# Altium project PCB_Project.PrjPcb
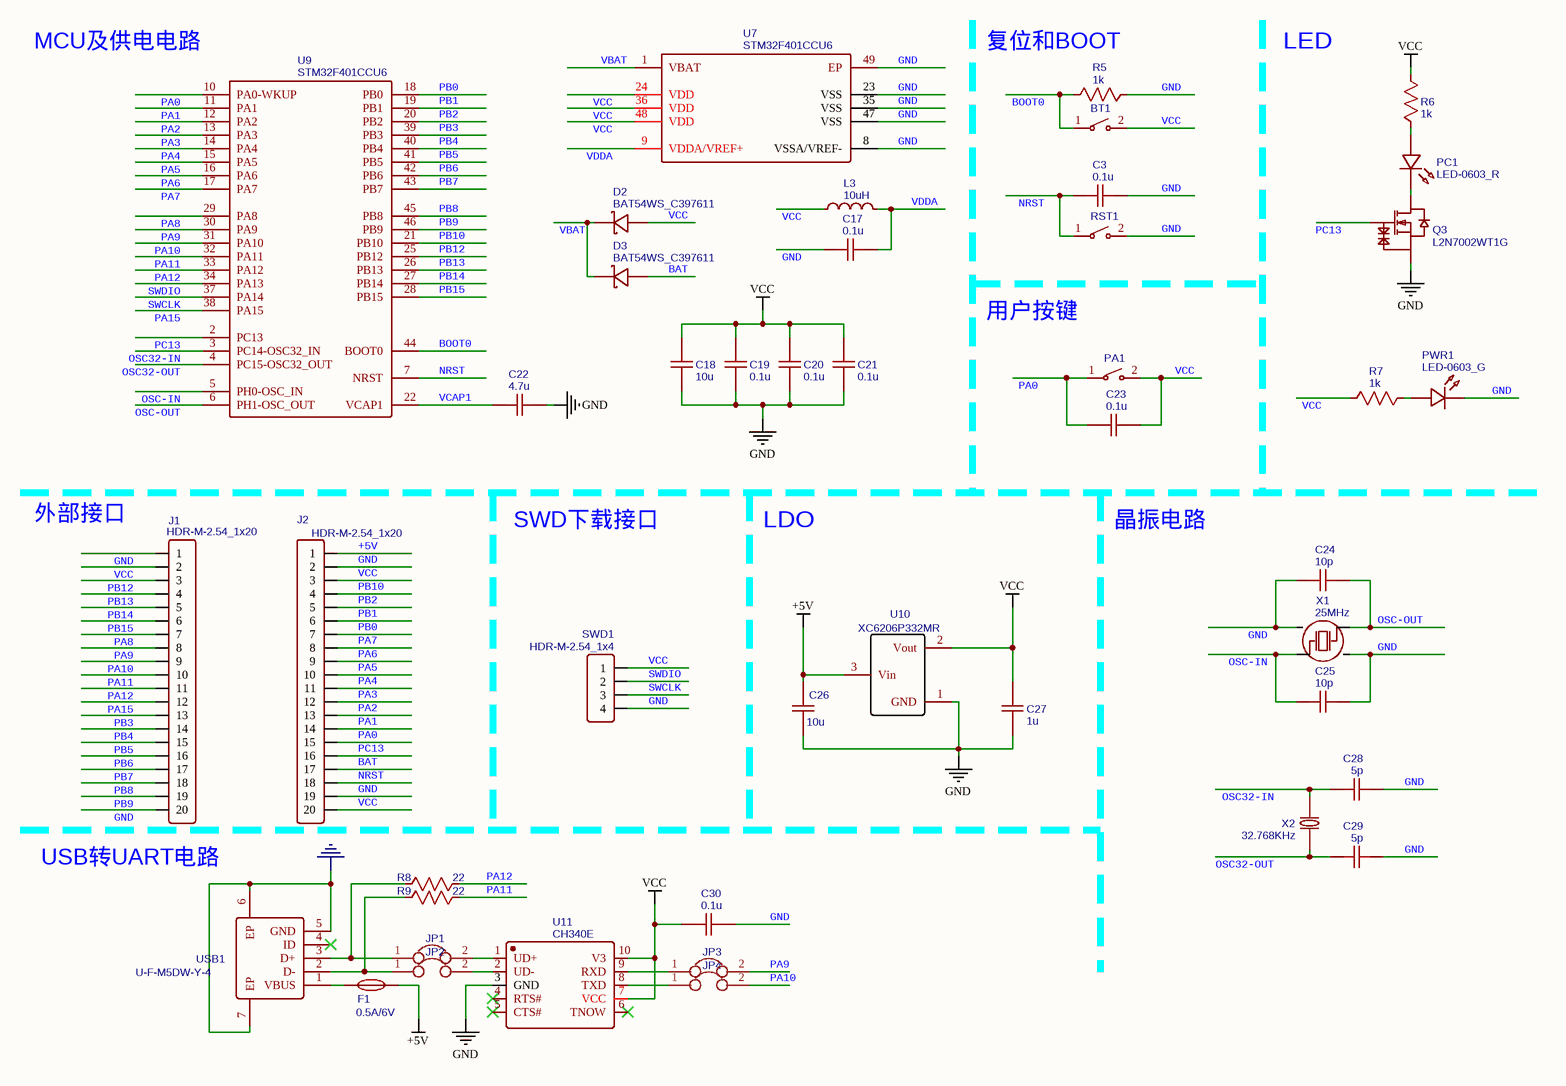
[diagram p0: Sheet1.SchDoc]
2 sheets, 107 parts. Net scope: hierarchical (ports join the sheet entries above them; power ports are global).
Board files: PCB1fbb.PcbDoc, body.PcbDoc
Sheets:
  Sheet1.SchDoc
  body.schdoc

## Sheet Sheet1.SchDoc
size A3; SheetNumber: 1; SheetTotal: 1

### Parts
BT1  TS-1088R-02026  [SW-SMD_L3.9-W3.0-P4.45]  (value not drawn)
C3  0.1u  [0603]
C17  0.1u  [0603]
C18  10u  [0603]
C19  0.1u  [0603]
C20  0.1u  [0603]
C21  0.1u  [0603]
C22  4.7u  [0603]
C23  0.1u  [0603]
C24  10p  [0603]
C25  10p  [0603]
C26  10u  [0603]
C27  1u  [0603]
C28  5p  [0603]
C29  5p  [0603]
C30  0.1u  [0603]
D2  BAT54WS_C397611
D3  BAT54WS_C397611
F1  0.5A/6V  [F0603]
J1  HDR-M-2.54_1x20  [HDR-M-2.54_1X20]
J2  HDR-M-2.54_1x20  [HDR-M-2.54_1X20]
JP1  JUMPER  [JUMPER-0603]  (value not drawn)
JP2  JUMPER  [JUMPER-0603]  (value not drawn)
JP3  JUMPER  [JUMPER-0603]  (value not drawn)
JP4  JUMPER  [JUMPER-0603]  (value not drawn)
L3  10uH  [L0805]
PA1  TS-1088R-02026  [SW-SMD_L3.9-W3.0-P4.45]  (value not drawn)
PC1  LED-0603_R  [LED0603_RED]
PWR1  LED-0603_G  [LED0603_GREEN]
Q3  L2N7002WT1G  [SC-70-3_L2.1-W1.3-P1.30-LS2.1-BR]
R5  1k  [R0603]
R6  1k  [R0603]
R7  1k  [R0603]
R8  22  [R0603]
R9  22  [R0603]
RST1  TS-1088R-02026  [SW-SMD_L3.9-W3.0-P4.45]  (value not drawn)
SWD1  HDR-M-2.54_1x4  [HDR-M-2.54_1X4]
U7  STM32F401CCU6  [UFQFPN-48_L7.0-W7.0-P0.50-BL-EP]
U9  STM32F401CCU6  [UFQFPN-48_L7.0-W7.0-P0.50-BL-EP]
U10  XC6206P332MR  [SOT-23(SOT-23-3)]
U11  CH340E  [MSOP-10_L3.0-W3.0-P0.50-LS5.0-BL]
USB1  U-F-M5DW-Y-4  [MICRO-USB-A12]
X1  25MHz  [OSC-SMD_4P-L3.2-W2.5-BL]
X2  32.768KHz  [OSC-SMD_L3.2-W1.5]

### Nets
+5V: C26.2 F1.2 J2.1 U10.3(Vin)
GND: C3.1 C17.2 C18.1 C19.1 C20.1 C21.1 C22.2 C24.1 C25.2 C26.1 C27.1 C28.1 C29.1 C30.1 J1.1 J1.20 J2.2 J2.19 PWR1.2 Q3.2(S) R5.2 RST1.2 SWD1.4 U7.8(VSSA/VREF-) U7.23(VSS) U7.35(VSS) U7.47(VSS) U7.49(EP) U10.1(GND) U11.3(GND) USB1.5(GND) USB1.6(EP) USB1.7(EP) X1.2 X1.4
VCC: BT1.2 C18.2 C19.2 C20.2 C21.2 C23.1 C27.2 C30.2 D2.2(A) J1.2 J2.3 J2.20 L3.1 PA1.2 R6.2 R7.2 SWD1.1 U7.24(VDD) U7.36(VDD) U7.48(VDD) U10.2(Vout) U11.7(VCC) U11.10(V3)
BAT: D3.2(A) J2.17
BOOT0: BT1.1 R5.1 U9.44(BOOT0)
NRST: C3.2 J2.18 RST1.1 U9.7(NRST)
OSC32-IN: C28.2 U9.3(PC14-OSC32_IN) X2.2
OSC32-OUT: C29.2 U9.4(PC15-OSC32_OUT) X2.1
OSC-IN: C25.1 U9.5(PH0-OSC_IN) X1.1
OSC-OUT: C24.2 U9.6(PH1-OSC_OUT) X1.3
PA0: C23.2 J2.15 PA1.1 U9.10(PA0-WKUP)
PA1: J2.14 U9.11(PA1)
PA2: J2.13 U9.12(PA2)
PA3: J2.12 U9.13(PA3)
PA4: J2.11 U9.14(PA4)
PA5: J2.10 U9.15(PA5)
PA6: J2.9 U9.16(PA6)
PA7: J2.8 U9.17(PA7)
PA8: J1.7 U9.29(PA8)
PA9: J1.8 JP3.2 U9.30(PA9)
PA10: J1.9 JP4.2 U9.31(PA10)
PA11: J1.10 R9.2 U9.32(PA11)
PA12: J1.11 R8.2 U9.33(PA12)
PA15: J1.12 U9.38(PA15)
PB0: J2.7 U9.18(PB0)
PB1: J2.6 U9.19(PB1)
PB2: J2.5 U9.20(PB2)
PB3: J1.13 U9.39(PB3)
PB4: J1.14 U9.40(PB4)
PB5: J1.15 U9.41(PB5)
PB6: J1.16 U9.42(PB6)
PB7: J1.17 U9.43(PB7)
PB8: J1.18 U9.45(PB8)
PB9: J1.19 U9.46(PB9)
PB10: J2.4 U9.21(PB10)
PB12: J1.3 U9.25(PB12)
PB13: J1.4 U9.26(PB13)
PB14: J1.5 U9.27(PB14)
PB15: J1.6 U9.28(PB15)
PC13: J2.16 Q3.1(G) U9.2(PC13)
SWCLK: SWD1.3 U9.37(PA14)
SWDIO: SWD1.2 U9.34(PA13)
VBAT: D2.1(C) D3.1(C) U7.1(VBAT)
VCAP1: C22.1 U9.22(VCAP1)
VDDA: C17.1 L3.2 U7.9(VDDA/VREF+)
NetF1_1: F1.1 USB1.1(VBUS)
NetJP1_1: JP1.1 R8.1 USB1.3(D+)
NetJP1_2: JP1.2 U11.1(UD+)
NetJP2_1: JP2.1 R9.1 USB1.2(D-)
NetJP2_2: JP2.2 U11.2(UD-)
NetJP3_1: JP3.1 U11.9(RXD)
NetJP4_1: JP4.1 U11.8(TXD)
NetPC1_1: PC1.1 R6.1
NetPC1_2: PC1.2 Q3.3(D)
NetPWR1_1: PWR1.1 R7.1

Not connected (* = marked no-connect by the designer): U11 4(RTS#)* 5(CTS#)* 6(TNOW)*; USB1 4(ID)*

### Notes on the sheet
- MCU及供电电路
- (near R5) 复位和BOOT
- LED
- 用户按键
- 外部接口
- SWD下载接口
- LDO
- 晶振电路
- (near J1) USB转UART电路

### Library data of the parts
BT1 PA1 RST1 = TS-1088R-02026: BOM_Manufacturer: XUNPU; Contributor: LCSC; BOM_Supplier: LCSC; BOM_Supplier Part: C455280; BOM_Manufacturer Part: TS-1088R-02026; spicePre: S; spiceSymbolName: TS-1088R-02026
C3 C17 C19-C21 C23 = 0.1u: nameAlias: Value(F); Contributor: LCEDA_Lib; spicePre: C; spiceSymbolName: C_0402_US
C18 = 10u: nameAlias: Value(F); Contributor: LCEDA_Lib; spicePre: C; spiceSymbolName: C_0805_US
C22 = 4.7u: nameAlias: Value(F); Contributor: LCEDA_Lib; spicePre: C; spiceSymbolName: C_0402_US
C24 C25 = 10p: nameAlias: Value(F); Contributor: LCEDA_Lib; spicePre: C; spiceSymbolName: C_0402_US
C26 = 10u: nameAlias: Value(F); spicePre: C; spiceSymbolName: Cap_0805_US
C27 = 1u: nameAlias: Value(F); spicePre: C; spiceSymbolName: Cap_RAD-0.1_US
C28 C29 = 5p: nameAlias: Value(F); Contributor: LCEDA_Lib; spicePre: C; spiceSymbolName: C_0402_US
C30 = 0.1u: nameAlias: Value(F); spicePre: C; spiceSymbolName: Cap_0805_US
D2 D3 = BAT54WS_C397611: BOM_Manufacturer: AnBon; Contributor: LCSC; BOM_Supplier: LCSC; BOM_Supplier Part: C397611; BOM_Manufacturer Part: BAT54WS; spicePre: D; spiceSymbolName: BAT54WS_C397611
F1 = 0.5A/6V: BOM_Manufacturer: BOURNS; BOM_Manufacturer Part: MF-FSMF050X-2; Contributor: LCSC; BOM_Supplier: LCSC; BOM_Supplier Part: C210357; spicePre: F; spiceSymbolName: MF-FSMF050X-2
J1 J2 = HDR-M-2.54_1x20: Contributor: LCEDA_Lib; BOM_Supplier Part: C50981; BOM_Supplier: LCSC; spicePre: J; spiceSymbolName: HDR-M-2.54_1x20
L3 = 10uH: BOM_Manufacturer: microgate; BOM_Manufacturer Part: MGFI2012D100KT-LF; nameAlias: Inductance; Contributor: LCSC; BOM_Supplier: LCSC; BOM_Supplier Part: C281097; spicePre: L; spiceSymbolName: MGFI2012D100KT-LF
PC1 = LED-0603_R: BOM_Manufacturer: EVERLIGHT(台湾亿光); BOM_Manufacturer Part: 19-217/R6C-AL1M2VY/3T; Contributor: LCEDA_01; BOM_Supplier Part: C72044; BOM_Supplier: LCSC; spicePre: L; spiceSymbolName: LED-0603_R
PWR1 = LED-0603_G: BOM_Manufacturer: EVERLIGHT(台湾亿光); BOM_Manufacturer Part: 19-217/GHC-YR1S2/3T; Contributor: LCEDA_Lib; BOM_Supplier Part: C72043; BOM_Supplier: LCSC; spicePre: L; spiceSymbolName: LED-0603_G
Q3 = L2N7002WT1G: BOM_Manufacturer: LRC; SMT Type: Extend; BOM_Supplier: LCSC; BOM_Manufacturer Part: L2N7002WT1G; BOM_Supplier Part: C12778; BOM_LCSC Assembly: Yes; spicePre: Q; spiceSymbolName: L2N7002WT1G
R5-R7 = 1k: nameAlias: Value(Ω); Contributor: LCEDA_Lib; spicePre: R; spiceSymbolName: R_0402_US
R8 R9 = 22: nameAlias: Value(Ω); Contributor: LCEDA_Lib; spicePre: R; spiceSymbolName: R_0603_US
SWD1 = HDR-M-2.54_1x4: Contributor: LCEDA_Lib; BOM_Supplier Part: C124378; BOM_Supplier: LCSC; spicePre: J; spiceSymbolName: HDR-M-2.54_1x4
U7 U9 = STM32F401CCU6: BOM_Manufacturer: ST; subpart_no: 1; tags: STM32; BOM_Supplier Part: C79861; BOM_Supplier: LCSC; BOM_Manufacturer Part: STM32F401CCU6; spicePre: U; spiceSymbolName: STM32F401CCU6
U10 = XC6206P332MR: BOM_Manufacturer: TOREX; SMT Type: Basic; BOM_Supplier: LCSC; BOM_Manufacturer Part: XC6206P332MR; BOM_LCSC Assembly: Yes; image: //image.lceda.cn/szlcsc/C5446.jpg; BOM_Supplier Part: C5446; spicePre: U
U11 = CH340E: BOM_Manufacturer: WCH; SMT Type: Extend; BOM_Supplier: LCSC; BOM_Manufacturer Part: CH340E; BOM_Supplier Part: C99652; BOM_LCSC Assembly: Yes; spicePre: U; spiceSymbolName: CH340E
USB1 = U-F-M5DW-Y-4: BOM_Manufacturer: HRO; Contributor: LCSC; BOM_Supplier: LCSC; BOM_Manufacturer Part: U-F-M5DW-Y-4; BOM_Supplier Part: C145784; spicePre: U
X1 = 25MHz: BOM_Manufacturer: Zhejiang Abel Elec; BOM_Manufacturer Part: TAXM8M4RDBCCT2T; nameAlias: Frequency; Contributor: LCSC; SMT Type: Extend; BOM_Supplier: LCSC; BOM_Supplier Part: C400090; BOM_LCSC Assembly: Yes; spicePre: X; spiceSymbolName: TAXM8M4RDBCCT2T
X2 = 32.768KHz: BOM_Manufacturer: EPSON; BOM_Manufacturer Part: Q13FC1350004900; nameAlias: Frequency; BOM_Supplier: LCSC; BOM_Supplier Part: C95361; spicePre: X; spiceSymbolName: Q13FC1350004900
JP1-JP4 = JUMPER: spicePre: J; spiceSymbolName: JUMPER

## Sheet body.schdoc
size A3; SheetNumber: 2; SheetTotal: 2
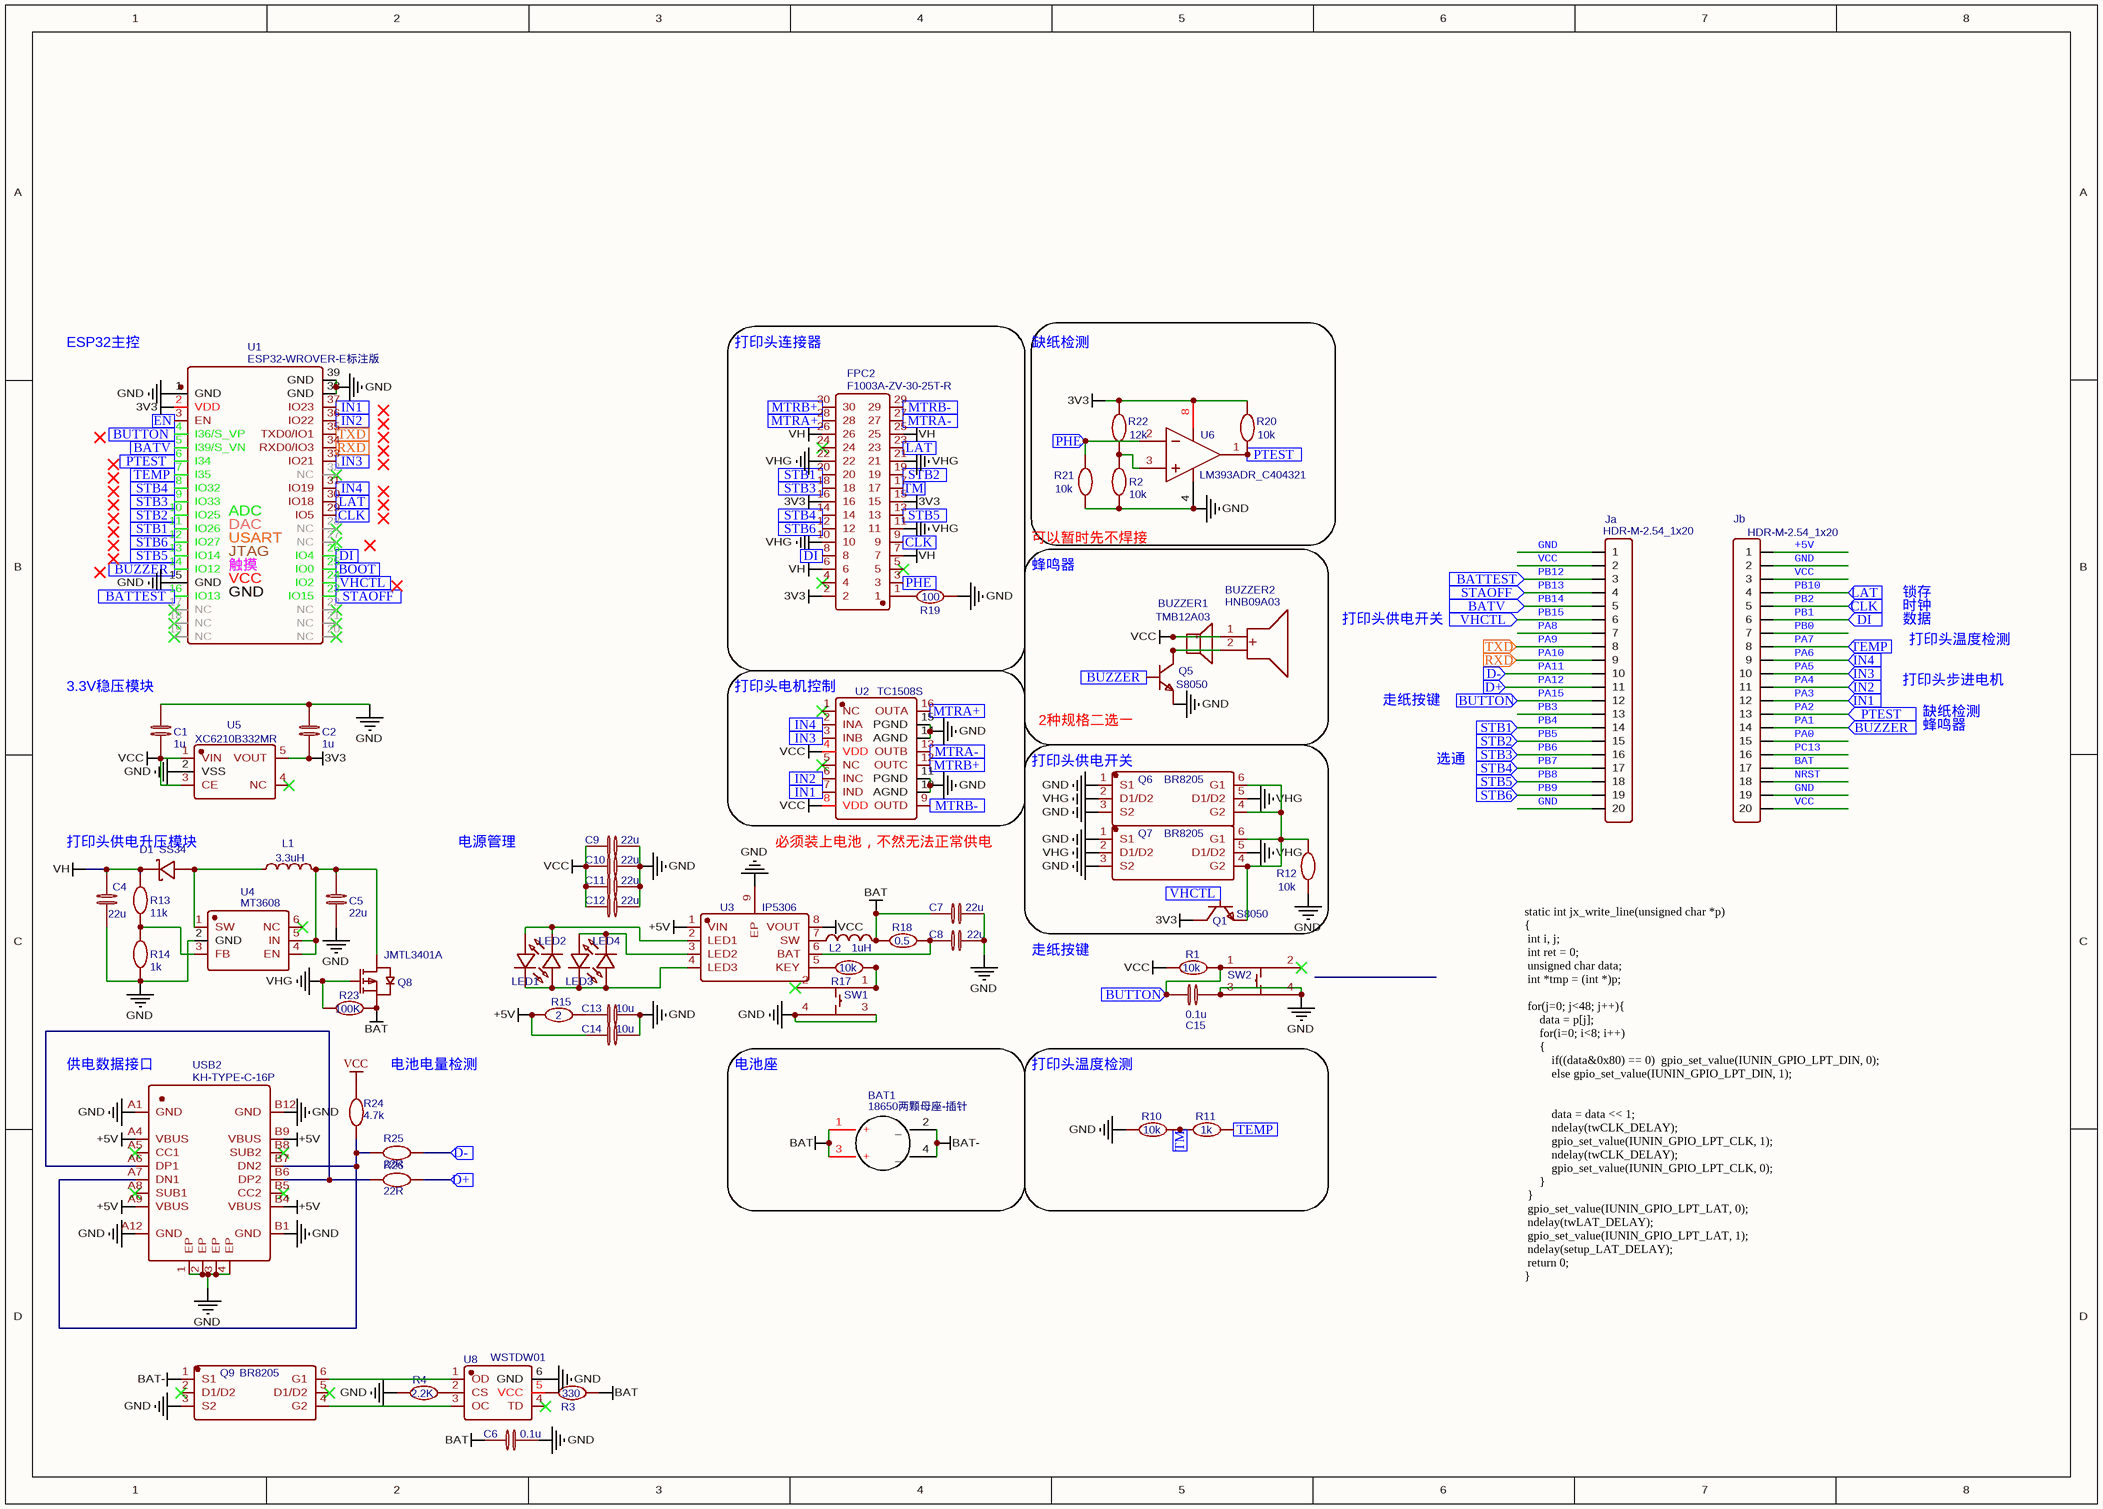
[diagram p1: body.schdoc]

### Parts
BAT1  18650两颗母座-插针  [18650两颗母座-插针]
BUZZER1  TMB12A03  [BUZ-TH_BD12.0-P7.60-D0.6-FD]
BUZZER2  HNB09A03  [BUZ-TH_BD9.0-P5.00-D0.6-FD]
C1  1u  [C0603]
C2  1u  [C0603]
C4  22u  [C1206]
C5  22u  [C1206]
C6  0.1u  [C0603]
C7  22u  [C0603]
C8  22u  [C0603]
C9  22u  [C0603]
C10  22u  [C0603]
C11  22u  [C0603]
C12  22u  [C0603]
C13  10u  [C0603]
C14  10u  [C0603]
C15  0.1u  [C0603]
D1  SS34  [SMA_L4.3-W2.6-LS5.2-RD]
FPC2  F1003A-ZV-30-25T-R  [FPC-SMD_F1003A-ZV-30-25T-R]
Ja  HDR-M-2.54_1x20  [HDR-M-2.54_1X20]
Jb  HDR-M-2.54_1x20  [HDR-M-2.54_1X20]
L1  3.3uH  [IND-SMD_L7.1-W6.6]
L2  1uH  [IND-SMD_L5.8-W5.2]
LED1  LED-0603_B  [LED0603_RED]  (value not drawn)
LED2  LED-0603_B  [LED0603_RED]  (value not drawn)
LED3  LED-0603_B  [LED0603_RED]  (value not drawn)
LED4  LED-0603_B  [LED0603_RED]  (value not drawn)
Q1  S8050  [SOT-23-3_L3.0-W1.7-P0.95-LS2.9-BR]
Q5  S8050  [SOT-23-3_L3.0-W1.7-P0.95-LS2.9-BR]
Q6  BR8205  [SOT-23-6_L2.9-W1.6-P0.95-LS2.8-BR]
Q7  BR8205  [SOT-23-6_L2.9-W1.6-P0.95-LS2.8-BR]
Q8  JMTL3401A  [SOT-23-3_L2.9-W1.3-P1.90-LS2.4-BR]
Q9  BR8205  [SOT-23-6_L2.9-W1.6-P0.95-LS2.8-BR]
R1  10k  [R0603]
R2  10k  [R0603]
R3  330  [R0603]
R4  2.2K  [R0603]
R10  10k  [R0603]
R11  1k  [R0603]
R12  10k  [R0603]
R13  11k  [R0603]
R14  1k  [R0603]
R15  2  [R0603]
R17  10k  [R0603]
R18  0.5  [R0603]
R19  100  [R0603]
R20  10k  [R0603]
R21  10k  [R0603]
R22  12k  [R0603]
R23  100K  [R0603]
R24  4.7k  [R0603]
R25  22R  [R0603]
R26  22R  [R0603]
SW1  1TS005F-2500-5001  [KEY-SMD_4P-L6.0-W6.0-P4.50]  (value not drawn)
SW2  1TS005F-2500-5001  [KEY-SMD_4P-L6.0-W6.0-P4.50]  (value not drawn)
U1  ESP32-WROVER-E标注版  [ESP32_WROVER/WROOM/SOLO]
U2  TC1508S  [SOP-16_L10.0-W3.9-P1.27-LS6.0-BL]
U3  IP5306  [ESOP-8_L4.9-W3.9-P1.27-LS6.0-BL-EP]
U4  MT3608  [SOT-23-6_L2.9-W1.6-P0.95-LS2.8-BR]
U5  XC6210B332MR  [SOT-25_L3.0-W1.6-P0.95-LS2.8-BL]
U6  LM393ADR_C404321  [SOP-8_L4.9-W3.9-P1.27-LS6.0-BL]
U8  WSTDW01  [SOT-23-6_L2.9-W1.6-P0.95-LS2.8-BR]
USB2  KH-TYPE-C-16P  [USB-C-SMD_TYPE-C16PIN]

### Blocks framed on the sheet
打印头连接器: FPC2 R19
打印头电机控制: U2
电池座: BAT1
打印头温度检测: R10 R11

### Ports
BATTEST (in), BATV (in), BOOT (in), BUTTON (in), BUZZER (in), CLK (in), D+ (in), D- (in), DI (in), EN (in), IN1 (in), IN2 (in), IN3 (in), IN4 (in), LAT (in), MTRA+ (in), MTRA- (in), MTRB+ (in), MTRB- (in), PHE (in), PTEST (in), RXD (in), STAOFF (in), STB1 (in), STB2 (in), STB3 (in), STB4 (in), STB5 (in), STB6 (in), TEMP (in), TM (in), TXD (in), VHCTL (in)

### Nets
3V3: C2.2 FPC2.2 FPC2.15 FPC2.16 Q1.3(C) R20.1 R22.1 U1.2(VDD) U5.5(VOUT) U6.8(VCC)
+5V: C14.1 Jb.1 R15.1 U3.1(VIN) USB2.A4(VBUS) USB2.A9(VBUS) USB2.B4(VBUS) USB2.B9(VBUS)
BAT: BAT1.1(+) BAT1.3(+) C6.1 C7.1 Jb.17 L2.2 Q8.2(S) R3.2 R18.1 R23.2
BAT-: BAT1.2(_) BAT1.4(_) Q9.1(S1)
GND: C1.1 C2.1 C4.2 C5.2 C6.2 C7.2 C8.2 C9.2 C10.2 C11.2 C12.2 C13.2 C14.2 C15.2 Ja.1 Ja.20 Jb.2 Jb.19 Q5.2(E) Q6.1(S1) Q6.3(S2) Q7.1(S1) Q7.3(S2) Q9.3(S2) R2.2 R4.1 R10.1 R12.1 R14.2 R19.1 R21.2 SW1.3 SW1.4 SW2.3 SW2.4 U1.1(GND) U1.15(GND) U1.38(GND) U1.39(GND) U2.10(AGND) U2.11(PGND) U2.14(AGND) U2.15(PGND) U3.9(EP) U4.2(GND) U5.2(VSS) U6.4(GND) U8.6(GND) USB2.1(EP) USB2.2(EP) USB2.3(EP) USB2.4(EP) USB2.A1(GND) USB2.A12(GND) USB2.B1(GND) USB2.B12(GND)
VCC: BUZZER1.1(+) BUZZER2.1(+) C1.2 C9.1 C10.1 C11.1 C12.1 Ja.2 Jb.3 Jb.20 R1.1 R24.1 U2.4(VDD) U2.8(VDD) U3.8(VOUT) U5.1(VIN) U5.3(CE)
VH: C4.1 D1.1(K) FPC2.6 FPC2.7 FPC2.25 FPC2.26 R13.1
VHG: FPC2.10 FPC2.11 FPC2.21 FPC2.22 Q6.2(D1/D2) Q6.5(D1/D2) Q7.2(D1/D2) Q7.5(D1/D2) Q8.1(G) R23.1
NRST: Jb.18
PA0: Jb.15
PA1: Jb.14 Q5.1(B) U1.14(IO12) ; port BUZZER
PA2: Jb.13 R20.2 U1.6(I34) U6.1(OUTA) ; port PTEST
PA3: Jb.12 U1.37(IO23) U2.7(IND) ; port IN1
PA4: Jb.11 U1.36(IO22) U2.6(INC) ; port IN2
PA5: Jb.10 U1.33(IO21) U2.3(INB) ; port IN3
PA6: Jb.9 U1.31(IO19) U2.2(INA) ; port IN4
PA7: Jb.8 R11.2 U1.7(I35) ; port TEMP
PA8: Ja.7
PA9: Ja.8 U1.35(TXD0/IO1) ; port TXD
PA10: Ja.9 U1.34(RXD0/IO3) ; port RXD
PA11: Ja.10 R25.2 ; port D-
PA12: Ja.11 R26.1 ; port D+
PA15: C15.1 Ja.12 R1.2 SW2.1 U1.4(I36/S_VP) ; port BUTTON
PB0: Jb.7
PB1: FPC2.8 Jb.6 U1.26(IO4) ; port DI
PB2: FPC2.9 Jb.5 U1.29(IO5) ; port CLK
PB3: Ja.13
PB4: FPC2.20 Ja.14 U1.11(IO26) ; port STB1
PB5: FPC2.19 Ja.15 U1.10(IO25) ; port STB2
PB6: FPC2.18 Ja.16 U1.9(IO33) ; port STB3
PB7: FPC2.14 Ja.17 U1.8(IO32) ; port STB4
PB8: FPC2.13 Ja.18 U1.13(IO14) ; port STB5
PB9: FPC2.12 Ja.19 U1.12(IO27) ; port STB6
PB10: FPC2.23 Jb.4 U1.30(IO18) ; port LAT
PB12: Ja.3 U1.16(IO13) ; port BATTEST
PB13: Ja.4 U1.23(IO15) ; port STAOFF
PB14: Ja.5 U1.5(I39/S_VN) ; port BATV
PB15: Ja.6 Q1.1(B) U1.24(IO2) ; port VHCTL
PC13: Jb.16
NetBUZZER1_2: BUZZER1.2 BUZZER2.2(-) Q5.3(C)
NetC5_1: C5.1 L1.2 Q8.3(D) U4.4(EN) U4.5(IN)
NetC8_1: C8.1 R18.2 U3.6(BAT)
NetC13_1: C13.1 R15.2
NetD1_2: D1.2(A) L1.1 U4.1(SW)
NetFPC2_1: FPC2.1 R19.2
NetFPC2_3: FPC2.3 R21.1 U6.2(INA-) ; port PHE
NetFPC2_17: FPC2.17 R10.2 R11.1 ; port TM
NetFPC2_27: FPC2.27 U2.13(OUTB) ; port MTRA-
NetFPC2_28: FPC2.28 U2.16(OUTA) ; port MTRA+
NetFPC2_29: FPC2.29 U2.9(OUTD) ; port MTRB-
NetFPC2_30: FPC2.30 U2.12(OUTC) ; port MTRB+
NetL2_1: L2.1 U3.7(SW)
NetLED1_1: LED1.1 LED2.2 U3.2(LED1)
NetLED1_2: LED1.2 LED2.1 LED3.2 LED4.1 U3.4(LED3)
NetLED3_1: LED3.1 LED4.2 U3.3(LED2)
NetQ1_2: Q1.2(E) Q6.4(G2) Q6.6(G1) Q7.4(G2) Q7.6(G1) R12.2
NetQ9_4: Q9.4(G2) U8.3(OC)
NetQ9_6: Q9.6(G1) U8.1(OD)
NetR2_1: R2.1 R22.2 U6.3(INA+)
NetR3_1: R3.1 U8.5(VCC)
NetR4_2: R4.2 U8.2(CS)
NetR13_2: R13.2 R14.1 U4.3(FB)
NetR17_1: R17.1 U3.5(KEY)
NetR17_2: R17.2 SW1.1
NetR24_2: R24.2 R25.1 USB2.A7(DN1) USB2.B7(DN2)
NetR26_2: R26.2 USB2.A6(DP1) USB2.B6(DP2)
NetU1_3: U1.3(EN) ; port EN
NetU1_25: U1.25(IO0) ; port BOOT

Not connected (* = marked no-connect by the designer): FPC2 4* 5* 24*; Q9 2(D1/D2)* 5(D1/D2)*; SW1 2*; SW2 2*; U1 17(NC)* 18(NC)* 19(NC)* 20(NC)* 21(NC)* 22(NC)* 27(NC)* 28(NC)* 32(NC)*; U2 1(NC)* 5(NC)*; U4 6(NC)*; U5 4(NC)*; U8 4(TD)*; USB2 A5(CC1)* A8(SUB1)* B5(CC2)* B8(SUB2)*

### Notes on the sheet
- ESP32主控
- 缺纸检测
- 蜂鸣器
- 可以暂时先不焊接
- 打印头供电开关
- 数据
- 时钟
- 锁存
- 打印头温度检测
- (near C1) 3.3V稳压模块
- 走纸按键
- 打印头步进电机
- (near Q6) 打印头供电开关
- 2种规格二选一
- 选通
- 打印头供电升压模块
- 电源管理
- (near U2) 必须装上电池，不然无法正常供电
- 供电数据接口
- 电池电量检测
- static int jx_write_line(unsigned char *p)
  {
  int i, j;
  int ret = 0;
  unsigned char data;
  int *tmp = (int *)p;
  for(j=0; j<48; j++){
  data = p[j];
  for(i=0; i<8; i++)
  {
  if((data&0x80) == 0)  gpio_set_value(IUNIN_GPIO_LPT_DIN, 0);
  else gpio_set_value(IUNIN_GPIO_LPT_DIN, 1);
  data = data << 1;
  ndelay(twCLK_DELAY);
  gpio_set_value(IUNIN_GPIO_LPT_CLK, 1);
  ndelay(twCLK_DELAY);
  gpio_set_value(IUNIN_GPIO_LPT_CLK, 0);
  }
  }
  gpio_set_value(IUNIN_GPIO_LPT_LAT, 0);
  ndelay(twLAT_DELAY);
  gpio_set_value(IUNIN_GPIO_LPT_LAT, 1);
  ndelay(setup_LAT_DELAY);
  return 0;
  }
- (in symbol ESP32-WROVER-E标注版) ADC; DAC; USART; JTAG; 触摸; VCC

### Library data of the parts
BAT1 = 18650两颗母座-插针: Contributor: SakuraNeko; spicePre: B; spiceSymbolName: 18650两颗母座-插针
BUZZER1 = TMB12A03: BOM_Manufacturer: HNDZ; BOM_Paste Type: expand; BOM_Supplier: LCSC; BOM_Manufacturer Part: TMB12A03; BOM_Supplier Part: C96222; spicePre: B; spiceSymbolName: TMB12A03
BUZZER2 = HNB09A03: BOM_Manufacturer: Jiangsu Huaneng Elec; Contributor: LCSC; BOM_Paste Type: expand; BOM_Supplier: LCSC; BOM_Supplier Part: C96102; BOM_Manufacturer Part: HNB09A03; spicePre: B; spiceSymbolName: HNB09A03
C1 C2 = 1u: nameAlias: Value(F); Contributor: LCEDA_Lib; spicePre: C; spiceSymbolName: C_0603_EU
C4 C5 C7-C12 = 22u: nameAlias: Value(F); Contributor: LCEDA_Lib; spicePre: C
  C4 C5: spiceSymbolName: C_1206_EU
  C7-C12: spiceSymbolName: C_0603_EU
C6 C15 = 0.1u: as C3 on sheet Sheet1; spicePre: C; spiceSymbolName: C_0603_EU
C13 C14 = 10u: as C18 on sheet Sheet1; spicePre: C; spiceSymbolName: C_0603_EU
D1 = SS34: BOM_Manufacturer: KEXIN; Contributor: LCSC; BOM_Paste Type: expand; BOM_Supplier: LCSC; BOM_Supplier Part: C489140; BOM_Manufacturer Part: SS34; spicePre: D; spiceSymbolName: SS34_C489140
FPC2 = F1003A-ZV-30-25T-R: BOM_Manufacturer: XFCN; Contributor: LCSC; BOM_Supplier: LCSC; BOM_Supplier Part: C781900; BOM_Manufacturer Part: F1003A-ZV-30-25T-R; BOM_JLCPCB Part Class: Extended Part; spicePre: F; spiceSymbolName: F1003A-ZV-30-25T-R
Ja Jb = HDR-M-2.54_1x20: Contributor: LCEDA_Lib; BOM_Supplier Part: C50981; BOM_Supplier: LCSC; spicePre: J; spiceSymbolName: HDR-M-2.54_1x20
L1 = 3.3uH: BOM_Manufacturer: PROD Tech; BOM_Manufacturer Part: PSPMAC0603H-220M-ANF; nameAlias: Inductance; Contributor: LCSC; BOM_Supplier: LCSC; BOM_Supplier Part: C705336; spicePre: L; spiceSymbolName: PSPMAC0603H-220M-ANF
L2 = 1uH: BOM_Manufacturer: YJYCOIN; BOM_Manufacturer Part: YP0503-1R0M; nameAlias: Inductance; Contributor: LCSC; BOM_Supplier: LCSC; BOM_Supplier Part: C576592; spicePre: L; spiceSymbolName: YP0503-1R0M
LED1-LED4 = LED-0603_B: BOM_Manufacturer: EVERLIGHT(台湾亿光); BOM_Manufacturer Part: 19-217/BHC-ZL1M2RY/3T; Contributor: LCEDA_01; BOM_Supplier Part: C72041; BOM_Supplier: LCSC; spicePre: L; spiceSymbolName: LED-0603_B
Q1 Q5 = S8050: BOM_Manufacturer: (MDD) Jiangsu Yutai Elec; BOM_Manufacturer Part: S8050-J3Y; Contributor: LCSC; BOM_Paste Type: expand; BOM_Supplier: LCSC; BOM_Supplier Part: C364312; spicePre: Q; spiceSymbolName: S8050-J3Y
Q6 Q7 Q9 = BR8205: BOM_Manufacturer: BLUE ROCKET; Contributor: LCSC; BOM_Paste Type: expand; BOM_Supplier: LCSC; BOM_Supplier Part: C305455; BOM_Manufacturer Part: BR8205; spicePre: Q; spiceSymbolName: BR8205
Q8 = JMTL3401A: BOM_Manufacturer: Jiangsu JieJie Microelectronics; Contributor: LCSC; SMT Type: Extend; BOM_Supplier: LCSC; BOM_Supplier Part: C394037; BOM_Manufacturer Part: JMTL3401A; BOM_JLCPCB SMD: Yes; spicePre: Q; spiceSymbolName: JMTL3401A
R1 R2 R10 R12 R17 R20 R21 = 10k: nameAlias: Value(Ω); Contributor: LCEDA_Lib; spicePre: R; spiceSymbolName: R_0603_EU
R3 = 330: nameAlias: Value(Ω); Contributor: LCEDA_Lib; spicePre: R; spiceSymbolName: R_0603_EU
R4 = 2.2K: nameAlias: Value(Ω); Contributor: LCEDA_Lib; spicePre: R; spiceSymbolName: R_0603_EU
R11 R14 = 1k: as R5 on sheet Sheet1; spicePre: R; spiceSymbolName: R_0603_EU
R13 R24-R26 = 11k: nameAlias: Value(Ω); Contributor: LCEDA_Lib; spicePre: R; spiceSymbolName: R_0603_EU
R15 = 2: nameAlias: Value(Ω); Contributor: LCEDA_Lib; spicePre: R; spiceSymbolName: R_0603_EU
R18 = 0.5: nameAlias: Value(Ω); Contributor: LCEDA_Lib; spicePre: R; spiceSymbolName: R_0603_EU
R19 = 100: nameAlias: Value(Ω); Contributor: LCEDA_Lib; spicePre: R; spiceSymbolName: R_0603_EU
R22 = 12k: nameAlias: Value(Ω); Contributor: LCEDA_Lib; spicePre: R; spiceSymbolName: R_0603_EU
R23 = 100K: nameAlias: Value(Ω); Contributor: LCEDA_Lib; spicePre: R; spiceSymbolName: R_0603_EU
SW1 SW2 = 1TS005F-2500-5001: BOM_Manufacturer: HYP; Contributor: LCSC; BOM_Supplier: LCSC; BOM_Supplier Part: C255812; BOM_Manufacturer Part: 1TS005F-2500-5001; BOM_JLCPCB Part Class: Extended Part; spicePre: S; spiceSymbolName: 1TS005F-2500-5001
U1 = ESP32-WROVER-E标注版: BOM_Manufacturer: Espressif Systems; BOM_Manufacturer Part: ESP32-WROVER-E(16MB); Contributor: SakuraNeko; BOM_Supplier: LCSC; BOM_Supplier Part: C529589; spicePre: U; spiceSymbolName: ESP32-WROVER-E标注版
U2 = TC1508S: BOM_Manufacturer: FM; BOM_Paste Type: expand; BOM_Supplier: LCSC; BOM_Manufacturer Part: TC1508S; BOM_Supplier Part: C89480; spicePre: U; spiceSymbolName: TC1508S
U3 = IP5306: BOM_Manufacturer: INJOINIC; Contributor: LCSC; BOM_Supplier: LCSC; BOM_Supplier Part: C181692; BOM_Manufacturer Part: IP5306; BOM_JLCPCB Part Class: Extended Part; spicePre: U; spiceSymbolName: IP5306
U4 = MT3608: BOM_Manufacturer: AEROSEMI; BOM_Paste Type: recommend; BOM_Supplier: LCSC; BOM_Manufacturer Part: MT3608; BOM_Supplier Part: C84817; spicePre: U; spiceSymbolName: MT3608
U5 = XC6210B332MR: BOM_Manufacturer: Torex Semicon; Contributor: LCSC; SMT Type: Extend; BOM_Supplier: LCSC; BOM_Supplier Part: C424705; BOM_Manufacturer Part: XC6210B332MR; BOM_JLCPCB SMD: Yes; spicePre: U; spiceSymbolName: XC6210B332MR_C424705
U6 = LM393ADR_C404321: BOM_Manufacturer: Youtai Semiconductor Co., Ltd.; subpart_no: 1; BOM_Supplier: LCSC; BOM_Supplier Part: C404321; BOM_Manufacturer Part: LM393ADR; spicePre: U; spiceSymbolName: LM393ADR_C404321
U8 = WSTDW01: BOM_Manufacturer: WINSOK; BOM_Paste Type: expand; BOM_Supplier: LCSC; BOM_Manufacturer Part: WSTDW01; BOM_Supplier Part: C86873; spicePre: U; spiceSymbolName: WSTDW01
USB2 = KH-TYPE-C-16P: BOM_Manufacturer: Shenzhen Kinghelm Elec; Contributor: LCSC; BOM_Supplier: LCSC; BOM_Supplier Part: C709357; BOM_Manufacturer Part: KH-TYPE-C-16P; spicePre: U; spiceSymbolName: KH-TYPE-C-16P

## Nets that join several sheets
+5V: Sheet1 (C26.2 F1.2 J2.1 U10.3), body (8 pins)
GND: Sheet1 (35 pins), body (56 pins)
VCC: Sheet1 (23 pins), body (17 pins)